# Altium schematic sheet 01_MCU.SchDoc
size A; SheetNumber: 1; SheetTotal: 3
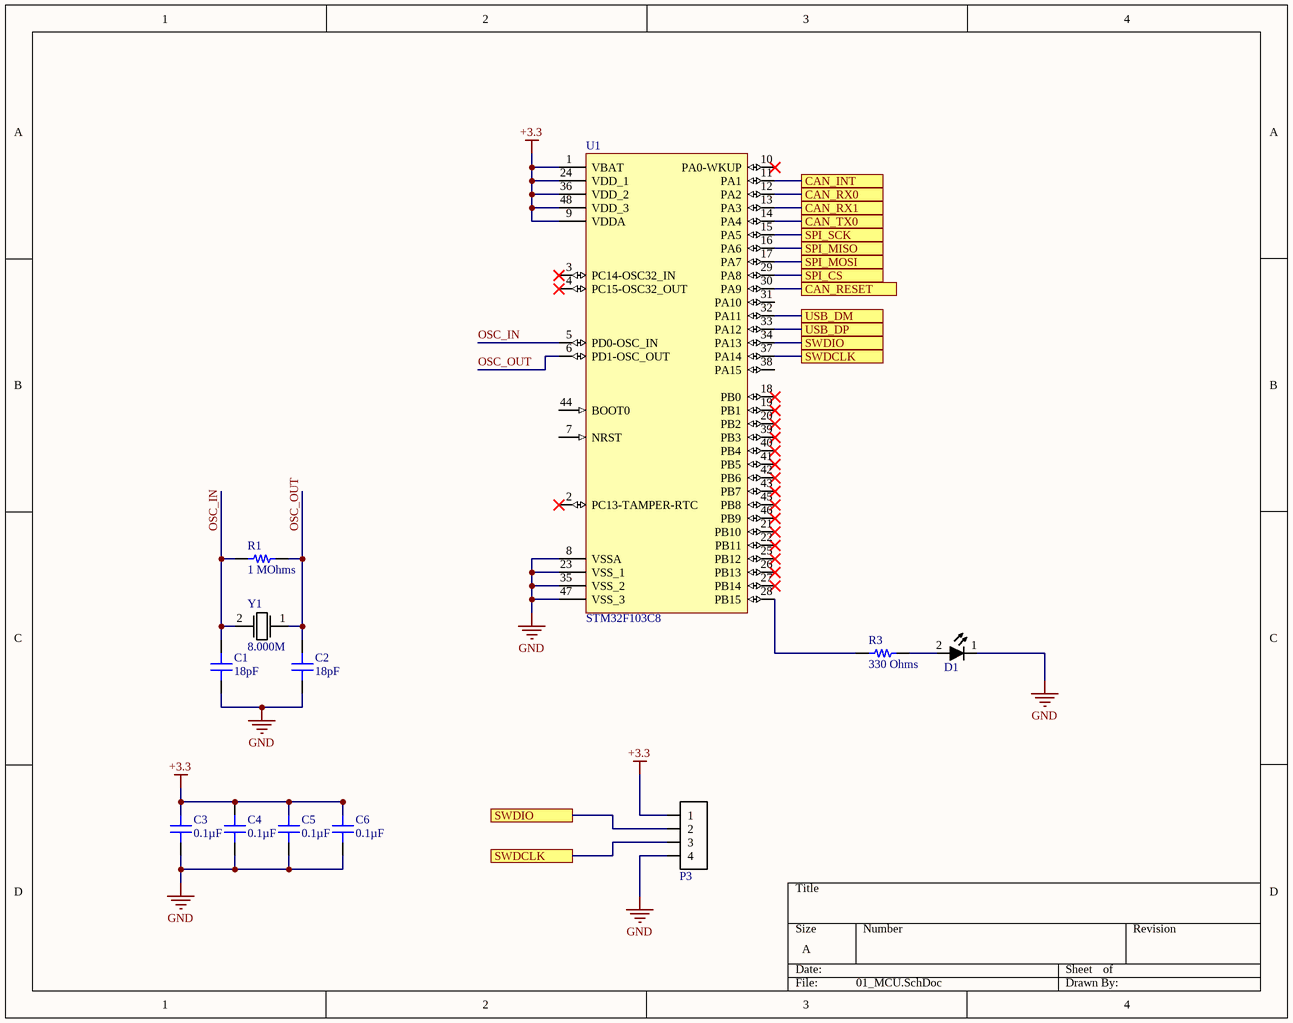
[diagram p0: 01_MCU.SchDoc]

## Parts
C1  18pF  [CAP 0603_1608]
C2  18pF  [CAP 0603_1608]
C3  0.1µF  [CAP 0805_2012]
C4  0.1µF  [CAP 0805_2012]
C5  0.1µF  [CAP 0805_2012]
C6  0.1µF  [CAP 0805_2012]
D1  diode_4  [chip_0603_LED]  (value not drawn)
P3  conn-4x1_0  [HDDR_4x1_0]  (value not drawn)
R1  1 MOhms  [RES 0603_1608]
R3  330 Ohms  [RES 0603_1608]
U1  STM32F103C8  [LQFP48_0]
Y1  Frequency: 8.000M  [ABLS_AT49_OSC]  (hidden comment: osc_xtal_2p_0)

## Ports
CAN_INT, CAN_RESET, CAN_RX0, CAN_RX1, CAN_TX0, SPI_CS, SPI_MISO, SPI_MOSI, SPI_SCK, SWDCLK, SWDIO, USB_DM, USB_DP

## Nets
+3.3: C3.2 C4.2 C5.2 C6.2 P3.1 U1.1(VBAT) U1.9(VDDA) U1.24(VDD_1) U1.36(VDD_2) U1.48(VDD_3)
GND: C1.1 C2.1 C3.1 C4.1 C5.1 C6.1 D1.1 P3.4 U1.8(VSSA) U1.23(VSS_1) U1.35(VSS_2) U1.47(VSS_3)
CAN_INT: U1.11(PA1) ; port CAN_INT
CAN_RESET: U1.30(PA9) ; port CAN_RESET
CAN_RX0: U1.12(PA2) ; port CAN_RX0
CAN_RX1: U1.13(PA3) ; port CAN_RX1
CAN_TX0: U1.14(PA4) ; port CAN_TX0
OSC_IN: C1.2 R1.1 U1.5(PD0-OSC_IN) Y1.2
OSC_OUT: C2.2 R1.2 U1.6(PD1-OSC_OUT) Y1.1
SPI_CS: U1.29(PA8) ; port SPI_CS
SPI_MISO: U1.16(PA6) ; port SPI_MISO
SPI_MOSI: U1.17(PA7) ; port SPI_MOSI
SPI_SCK: U1.15(PA5) ; port SPI_SCK
SWDCLK: P3.3 U1.37(PA14) ; port SWDCLK
SWDIO: P3.2 U1.34(PA13) ; port SWDIO
USB_DM: U1.32(PA11) ; port USB_DM
USB_DP: U1.33(PA12) ; port USB_DP
NetD1_2: D1.2 R3.2
NetR3_1: R3.1 U1.28(PB15)

Not connected (* = marked no-connect by the designer): U1 2(PC13-TAMPER-RTC)* 3(PC14-OSC32_IN)* 4(PC15-OSC32_OUT)* 7(NRST) 10(PA0-WKUP)* 18(PB0)* 19(PB1)* 20(PB2)* 21(PB10)* 22(PB11)* 25(PB12)* 26(PB13)* 27(PB14)* 31(PA10) 38(PA15) 39(PB3)* 40(PB4)* 41(PB5)* 42(PB6)* 43(PB7)* 44(BOOT0) 45(PB8)* 46(PB9)*

## Library data of the parts
C1 C2 = C0603X180J5GACTU: CAP CER 18PF 50V C0G/NP0 0603; Manufacturer: KEMET; Temperature Coefficient: C0G, NP0; Tolerance: ±5%; Part Number: C0603X180J5GACTU; Value: 18pF; Applications: Boardflex Sensitive; Capacitance: 18pF; ComponentLink1Description: Datasheet; ComponentLink1URL: https://api.kemet.com/component-edge/download/specsheet/C0603X180J5GACTU.pdf; ComponentLink2Description: DigiKey Link; ComponentLink2URL: http://digikey.com/product-detail/en/kemet/C0603X180J5GACTU/399-7390-1-ND/3317424; Device Package: 0603 (1608 Metric); Features: Low ESL, Soft Termination; LastUpdated: 9/2/2020 1:03:35 AM; Lifecycle Status: Active; Minimum Order: 1; Mounting Type: Surface Mount, MLCC; Operating Temperature: -55°C ~ 125°C; Package / Case: 0603 (1608 Metric); Packaging: TapeAndReel; PartId: 2471; Part Status: Active; Price: 0.08; Series: SMD Comm C0G Flex; Size / Dimension: 0.063" L x 0.031" W (1.60mm x 0.80mm); Supplier 1: DigiKey; Supplier Part Number 1: 399-7390-1-ND; Thickness (Max): 0.034" (0.87mm); Voltage - Rated: 50V
C3-C6 = C0805X104K5RAC3316: CAP CER 0805 0.1UF 50V X7R; Manufacturer: KEMET; Tolerance: ±10%; Part Number: C0805X104K5RAC3316; Value: 0.1µF; Applications: Automotive, Boardflex Sensitive; Capacitance: 0.1µF; ComponentLink1Description: Datasheet; ComponentLink1URL: https://api.kemet.com/component-edge/download/datasheet/C0805X104K5RAC3316.pdf; ComponentLink2Description: DigiKey Link; ComponentLink2URL: http://digikey.com/product-detail/en/kemet/C0805X104K5RAC3316/399-C0805X104K5RAC3316CT-ND/10315823; Device Package: 0805 (2012 Metric); Features: Soft Termination; LastUpdated: 9/2/2020 1:04:41 AM; Lifecycle Status: Active; Minimum Order: 1; Mounting Type: Surface Mount, MLCC; Operating Temperature: -55°C ~ 125°C; Package / Case: 0805 (2012 Metric); Packaging: TapeAndReel; PartId: 2769; Part Status: Active; Price: 0.08; Ratings: AEC-Q200; Series: SMD Auto X7R VW80808; Size / Dimension: 0.079" L x 0.049" W (2.00mm x 1.25mm); Supplier 1: DigiKey; Supplier Part Number 1: 399-C0805X104K5RAC3316CT-ND; Temperature Coefficient: X7R; Thickness (Max): 0.047" (1.20mm); Voltage - Rated: 50V
D1 = DIO-00049: LED, Blue, 0603, Low current, HELI2 Series; Manufacturer: Kingbright; Manufacturer PN: APT1608LVBC/D; Forward Voltage: 2.65V; Reverse Breakdown Voltage: 5V; Power Rating: 120mW; Current Rating: 30mA; Part Number: DIO-00049; Type: LED; Cost: 0.58
P3 = CONN-00029: Header 4x1, 0.1"; Positions per level: 4; Levels: 1; Part Number: CONN-00029; Type: Header
R1 = RCS06031M00FKEA: RES SMD 1M OHM 1% 1/4W 0603; Manufacturer: Vishay Dale; Power (Watts): 0.25W, 1/4W; Temperature Coefficient: ±100ppm/°C; Part Number: RCS06031M00FKEA; Value: 1 MOhms; ComponentLink1Description: Datasheet; ComponentLink1URL: http://www.vishay.com/docs/20065/rcse3.pdf; ComponentLink2Description: DigiKey Link; ComponentLink2URL: http://digikey.com/product-detail/en/vishay-dale/RCS06031M00FKEA/541-2803-1-ND/5867096; Composition: Thick Film; Device Package: 0603 (1608 Metric); Features: Automotive AEC-Q200, Pulse Withstanding; Height - Seated (Max): 0.020" (0.50mm); LastUpdated: 9/2/2020 1:09:49 AM; Lifecycle Status: Active; Minimum Order: 1; Number of Terminations: 2; Operating Temperature: -55°C ~ 155°C; Package / Case: 0603 (1608 Metric); Packaging: TapeAndReel; PartId: 21301; Part Status: Active; Price: 0.02; Ratings: AEC-Q200; Resistance: 1 MOhms; Series: RCS e3; Size / Dimension: 0.061" L x 0.033" W (1.55mm x 0.85mm); Supplier 1: DigiKey; Supplier Part Number 1: 541-2803-1-ND; Supplier Device Package: 0603; Tolerance: ±1%
R3 = RK73B1JTTD331J: RES 330 OHM 5% 1/8W 0603; Manufacturer: KOA Speer Electronics, Inc.; Power (Watts): 0.125W, 1/8W; Temperature Coefficient: ±200ppm/°C; Part Number: RK73B1JTTD331J; Value: 330 Ohms; ComponentLink1Description: Datasheet; ComponentLink1URL: http://www.koaspeer.com/catimages/Products/RK73B/RK73B.pdf; ComponentLink2Description: DigiKey Link; ComponentLink2URL: http://digikey.com/product-detail/en/koa-speer-electronics-inc/RK73B1JTTD331J/2019-RK73B1JTTD331JCT-ND/9846751; Composition: Thick Film; Device Package: 0603 (1608 Metric); Features: Automotive AEC-Q200, Moisture Resistant; Height - Seated (Max): 0.022" (0.55mm); LastUpdated: 9/2/2020 1:10:22 AM; Lifecycle Status: Active; Minimum Order: 1; Number of Terminations: 2; Operating Temperature: -55°C ~ 155°C; Package / Case: 0603 (1608 Metric); Packaging: CutTape; PartId: 5985; Part Status: Active; Price: 0.10; Ratings: AEC-Q200; Resistance: 330 Ohms; Series: RK73B; Size / Dimension: 0.063" L x 0.031" W (1.60mm x 0.80mm); Supplier 1: DigiKey; Supplier Part Number 1: 2019-RK73B1JTTD331JCT-ND; Supplier Device Package: 0603; Tolerance: ±5%
U1 = UCTRL-00008: STM32 M3, LQFP-48; Manufacturer: ST; Part Number: UCTRL-00008; Manufacturer PN: STM32F103C8
Y1 = OSC-00002: XTAL, 8MHz, 18pF, 20ppm; Manufacturer: Abracon; Manufacturer PN: ABLS-8.000MHZ-B2-T; ESR: 80; Stability: 50ppm; Load Capacitance: 18pF; Tolerance: 20ppm; Part Number: OSC-00002